# Altium schematic sheet YakupTrkn.SchDoc
size A4
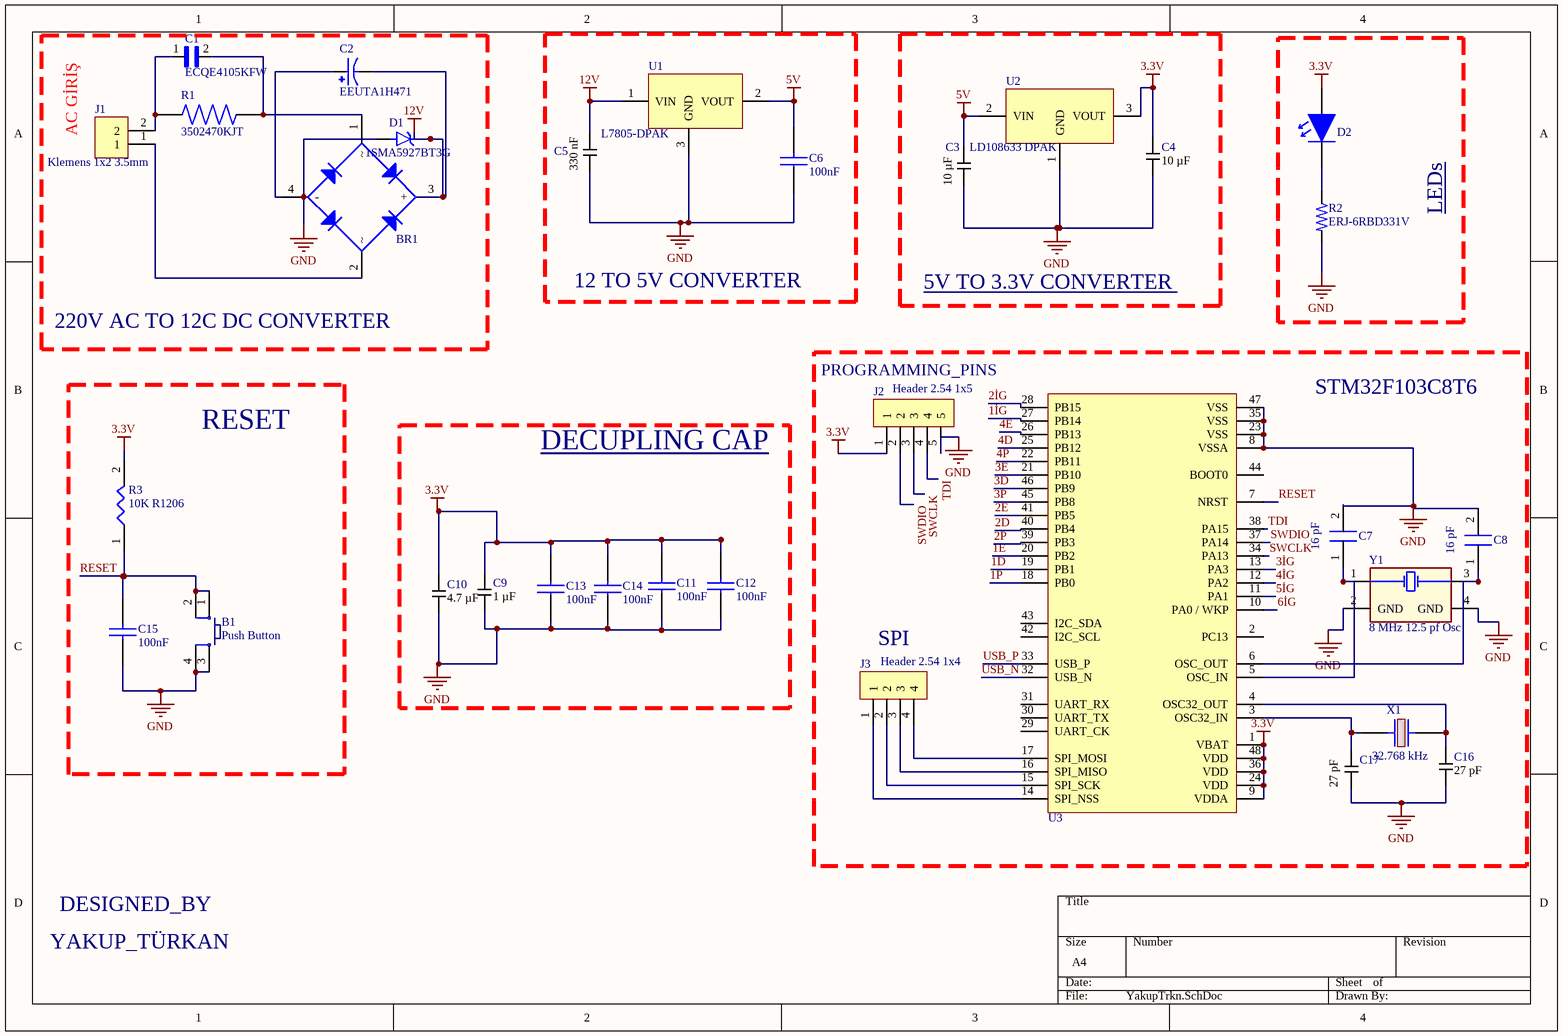
[diagram p0: YakupTrkn.SchDoc]

## Parts
B1  Push Button  [PUSB BUTTON-SMD]
BR1  DB105STR  [DB105STR]  (value not drawn)
C1  ECQE4105KFW  [CAPRR1500W80L2600T850H2300]
C2  EEUTA1H471  [CAPPRD750W80D1600H2000]
C3  Capacitance: 10 µF  [SAMSUNG_CAP_0805_140]  (hidden comment: CL21B106KPQNNNE)
C4  Capacitance: 10 µF  [SAMSUNG_CAP_0805_140]  (hidden comment: CL21B106KPQNNNE)
C5  Capacitance: 330 nF  [SAMSUNG_CAP_0805_095]  (hidden comment: CL21B334KOCNNNC)
C6  Capacitance: 100nF  [CAP_0603]  (hidden comment: C0603C104K5RACTU)
C7  16 pF  [C1206]
C8  16 pF  [C1206]
C9  Capacitance: 1 µF  [SAMSUNG_CAP_0805_135]  (hidden comment: CL21B105KBFNNNE)
C10  Capacitance: 4.7 µF  [SAMSUNG_CAP_0805_095]  (hidden comment: *)
C11  Capacitance: 100nF  [CAP_0603]  (hidden comment: C0603C104K5RACTU)
C12  Capacitance: 100nF  [CAP_0603]  (hidden comment: C0603C104K5RACTU)
C13  Capacitance: 100nF  [CAP_0603]  (hidden comment: C0603C104K5RACTU)
C14  Capacitance: 100nF  [CAP_0603]  (hidden comment: C0603C104K5RACTU)
C15  Capacitance: 100nF  [CAP_0603]  (hidden comment: C0603C104K5RACTU)
C16  Capacitance: 27 pF  [SAMSUNG_CAP_0805_075]  (hidden comment: CL21C270JBANNNC)
C17  Capacitance: 27 pF  [SAMSUNG_CAP_0805_075]  (hidden comment: CL21C270JBANNNC)
D1  1SMA5927BT3G  [DIOM5226X220N]
D2  LH R974-LP-1  [LED_RED_0805]  (value not drawn)
J1  Klemens 1x2 3.5mm  [Klemens 1x2 - 3.5mm]
J2  Header 2.54 1x5  [Header 2.54 1x5]
J3  Header 2.54 1x4  [Header 2.54 1x4]
R1  3502470KJT  [RESC5025X120N]
R2  ERJ-6RBD331V  [RESC2012X70]
R3  10K R1206  [R1206 Resıstor]
U1  L7805-DPAK  [DPAK228P972X230-3N]
U2  LD108633 DPAK  [DPAK228P972X230-3N]
U3  STM32F103C6T6A  [LQFP-48]  (value not drawn)
X1  Operating Frequency: 32.768 kHz  [ABS05]  (hidden comment: ABS05-32.768KHZ-T)
Y1  8 MHz 12.5 pf Osc  [8 MHZ Osc.]

## Nets
3.3V: C4.1 C9.2 C10.2 C11.2 C12.2 C13.2 C14.2 D2.2 J2.1 R3.2 U2.3(VOUT) U3.1(VBAT) U3.9(VDDA) U3.24(VDD) U3.36(VDD) U3.48(VDD)
5V: C3.2 C6.2 U1.2(VOUT) U2.2(VIN)
12V: BR1.3(+) C2.N C5.2 D1.C U1.1(VIN)
GND: B1.3 B1.4 C3.1 C4.2 C5.1 C6.1 C7.2 C8.2 C9.1 C10.1 C11.1 C12.1 C13.1 C14.1 C15.1 C16.1 C17.2 D1.A J2.5 R2.2 U1.3(GND) U2.1(GND) U3.8(VSSA) U3.23(VSS) U3.35(VSS) U3.47(VSS) Y1.2(GND) Y1.4(GND)
1D: U3.19(PB1)
1E: U3.20(PB2)
1İG: U3.27(PB14)
1P: U3.18(PB0)
2D: U3.40(PB4)
2E: U3.41(PB5)
2İG: U3.28(PB15)
2P: U3.39(PB3)
3D: U3.46(PB9)
3E: U3.21(PB10)
3İG: U3.13(PA3)
3P: U3.45(PB8)
4D: U3.25(PB12)
4E: U3.26(PB13)
4İG: U3.12(PA2)
4P: U3.22(PB11)
5İG: U3.11(PA1)
6İG: U3.10(PA0_/_WKP)
RESET: B1.1 B1.2 C15.2 R3.1 U3.7(NRST)
SWCLK: J2.3 U3.34(PA13)
SWDIO: J2.2 U3.37(PA14)
TDI: J2.4 U3.38(PA15)
USB_N: U3.32(USB_N)
USB_P: U3.33(USB_P)
NetBR1_1: BR1.1 C1.2 R1.2
NetBR1_2: BR1.2 J1.1
NetBR1_4: BR1.4(-) C2.P
NetC1_1: C1.1 J1.2 R1.1
NetC7_1: C7.1 U3.5(OSC_IN) Y1.1
NetC8_1: C8.1 U3.6(OSC_OUT) Y1.3
NetC16_2: C16.2 U3.4(OSC32_OUT) X1.2
NetC17_1: C17.1 U3.3(OSC32_IN) X1.1
NetD2_1: D2.1 R2.1
NetJ3_1: J3.1 U3.14(SPI_NSS)
NetJ3_2: J3.2 U3.15(SPI_SCK)
NetJ3_3: J3.3 U3.16(SPI_MISO)
NetJ3_4: J3.4 U3.17(SPI_MOSI)

Not connected (* = marked no-connect by the designer): U3 2(PC13) 29(UART_CK) 30(UART_TX) 31(UART_RX) 42(I2C_SCL) 43(I2C_SDA) 44(BOOT0)

## Notes on the sheet
- (near J1) AC GİRİŞ
- LEDs <leds>
- 12 TO 5V CONVERTER
- 5V TO 3.3V CONVERTER <5V TO 3.3V CONVERTER >
- 220V AC TO 12C DC CONVERTER
- (near J2) PROGRAMMING_PINS
- RESET
- STM32F103C8T6
- DECUPLING CAP
- (near J3) SPI
- DESIGNED_BY
- YAKUP_TÜRKAN

## Library data of the parts
B1 = Push Button: Smd Push Button; Satın Alma Linki: https://urun.n11.com/diger/mini-pushbutton-switch-smd-P227461537?gclid=Cj0KCQjwkoDmBRCcARIsAG3xzl8Y_-jeD7HocNM6lvuZ_rVp83568XPGtNzlPwXWLph8oCRqo0yh87UaApZYEALw_wcB&gclsrc=aw.ds
BR1 = DB105STR: Bridge Diode AC-DC; Manufacturer: Sangdest Microelectronics; Designed by: BERK; Max Current: 1A; Operating Voltage: 600V; Supplier 1: Digi-Key; Manufacturer Part Number: DB105STR; RoHS: No; Supplier Part Number 1: 1655-1821-1-ND
C1 = ECQE4105KFW: MF: {'manufacturer': u'Panasonic'}; MP: ECQE4105KFW; Price: None; Package: None; Value: *; Availability: Unavailable
C2 = EEUTA1H471: TA-A; MF: {'manufacturer': u'Panasonic'}; MP: EEUTA1H471; Price: None; Package: None; Value: *; Availability: Unavailable
C3 C4 = CL21B106KPQNNNE: CAP CER 10UF 10V X7R 0805; Supplier 1: Digi-Key; Supplier 2: Farnell; Supplier 3: Mouser; Supplier Part Number 1: 1276-1764-6-ND; Supplier Part Number 2: 3013487; Supplier Part Number 3: 187-CL21B106KPQNNNE
C5 = CL21B334KOCNNNC: CAP CER 0.33UF 16V X7R 0805; Supplier 1: Digi-Key; Supplier 2: Mouser; Supplier 3: Arrow Electronics; Supplier Part Number 1: 1276-1797-1-ND; Supplier Part Number 2: 187-CL21B334KOCNNNC; Supplier Part Number 3: CL21B334KOCNNNC
C6 C11-C15 = CAP CER 100nF 0603: CAP CER 100nF %10 0603 SMD; Manufacturer: KEMET; Designed by: BERK; Dielectric Material: Ceramic; Voltage Rating (DC): 50V; Tolerance: 10%; Dielectric: X7R; Dissipation Factor: 2.5%; Supplier 1: Digi-Key; Manufacturer Part Number: C0603C104K5RACTU; RoHS: Yes; Category: Ceramic Capacitors; Stock 1: 1666186; Pricing 1: 1=0,12000, 10=0,08500, 50=0,04620, 100=0,03770, 500=0,02696, 1000=0,02118 (USD); Mount: Surface Mount; Case/Package: 0603; Number of Pins: 2; Case Code (Metric): 1608; Case Code (Imperial): 0603; Contact Plating: Tin,Matte; Min Operating Temperature: -55°C; Max Operating Temperature: 125°C; Packaging: Tape and Reel; Package Quantity: 1; Termination: SMD/SMT; Voltage: 50V; Voltage Rating: 50V; Series: SMD Comm X7R; Length: 0.063inch; Width: 0.031inch; Height: 0.8mm; Thickness: 0.034inch; Lead Pitch: 0.7mm; Depth: 0.8mm; Radiation Hardening: No; RoHS Compliant: Yes; REACH SVHC: No SVHC; ComponentLink1URL: https://datasheet.ciiva.com/7823/kem-c1002-x7r-smd-7823591.pdf?src-supplier=Element14; ComponentLink1Description: https://datasheet.ciiva.com/7823/kem-c1002-x7r-smd-7823591.pdf?src-supplier=Element14; ComponentLink2URL: https://datasheet.ciiva.com/14602/70095383-14602583.pdf?src-supplier=Allied+Electronics; ComponentLink2Description: https://datasheet.ciiva.com/14602/70095383-14602583.pdf?src-supplier=Allied+Electronics; ComponentLink3URL: https://datasheet.ciiva.com/5999/kem-c1002-x7r-smd-5999400.pdf?src-supplier=Farnell; ComponentLink3Description: https://datasheet.ciiva.com/5999/kem-c1002-x7r-smd-5999400.pdf?src-supplier=Farnell; ComponentLink4URL: https://datasheet.ciiva.com/7823/kem-c1002-x7r-smd-7823592.pdf?src-supplier=Element14; ComponentLink4Description: https://datasheet.ciiva.com/7823/kem-c1002-x7r-smd-7823592.pdf?src-supplier=Element14; ComponentLink5URL: https://datasheet.ciiva.com/28645/1851736-28645640.pdf?src-supplier=Element14; ComponentLink5Description: https://datasheet.ciiva.com/28645/1851736-28645640.pdf?src-supplier=Element14; ComponentLink6URL: https://datasheet.ciiva.com/14585/70095383-14585209.pdf?src-supplier=Allied+Electronics; ComponentLink6Description: https://datasheet.ciiva.com/14585/70095383-14585209.pdf?src-supplier=Allied+Electronics; Supplier Part Number 1: 399-5089-1-ND
C9 = CL21B105KBFNNNE: CAP CER 1UF 50V X7R 0805; Supplier 1: Digi-Key; Supplier 2: Farnell; Supplier 3: Mouser; Supplier Part Number 1: 1276-1029-1-ND; Supplier Part Number 2: 3013482; Supplier Part Number 3: 187-CL21B105KBFNNNE
C10 = CL21A475KACLRNC: CAP CER 4.7UF 25V X5R 0805; Supplier 1: Digi-Key; Supplier 2: Mouser; Supplier 3: Arrow Electronics; Supplier Part Number 1: 1276-2415-1-ND; Supplier Part Number 2: 187-CL21A475KACLRNC; Supplier Part Number 3: CL21A475KACLRNC
C16 C17 = CL21C270JBANNNC: CAP CER 27PF 50V C0G/NP0 0805; Supplier 1: Digi-Key; Supplier Part Number 1: 1276-1285-1-ND
D1 = 1SMA5927BT3G: MF: {'manufacturer': u'ON Semiconductor'}; MP: 1SMA5927BT3G; Value: *; Availability: Unavailable; Package: None; Price: None
D2 = LED RED 0805: LED Uni-Color Hyper Red 660nm 2-Pin Chip 0805(2012Metric) T/R; Manufacturer: Osram Opto; Lens Color: White; Forward Voltage: 1.8V; Lens Style: Diffused,Flat,Colorless; Luminous Intensity: 71mcd; Viewing Angle: 160°; Forward Current: 30mA; Dominant Wavelength: 645nm; Number of Elements: 1; Test Current: 20mA; Reverse Voltage: 5V; Lens Transparency: Diffused; Luminous Flux: 0.17lm; Lens Size: 1.25mm; Designed by: BERK; Supplier 1: Digi-Key; Manufacturer Part Number: LH R974-LP-1; RoHS: Yes; Category: LEDs; Stock 1: 35632; Pricing 1: 1=0,26000, 10=0,13900, 100=0,06480, 500=0,05978, 1000=0,04683, 2000=0,04584 (USD); Mount: Surface Mount; Case/Package: 0805; Number of Pins: 2; Color: Red; Case Code (Imperial): 0805; Case Code (Metric): 2012; Min Operating Temperature: -30°C; Max Operating Temperature: 85°C; Packaging: Tape and Reel; Illumination Color: Red; Package Quantity: 1; Series: CHipLED; Length: 2.1mm; Width: 1.25mm; Depth: 1.35mm; Radiation Hardening: No; RoHS Compliant: Yes; ComponentLink1URL: http://www.jameco.com/Jameco/Products/ProdDS/2085634.pdf?src-supplier=Jameco; ComponentLink1Description: http://www.jameco.com/Jameco/Products/ProdDS/2085634.pdf?src-supplier=Jameco; ComponentLink2URL: http://components.arrow.com/part/dataview/0323_01825492?src-supplier=Arrow+Europe; ComponentLink2Description: http://components.arrow.com/part/dataview/0323_01825492?src-supplier=Arrow+Europe; ComponentLink3URL: https://dammedia.osram.info/media/resource/hires/osram-dam-2493888/LH%20R974.pdf?src-supplier=Digi-Key; ComponentLink3Description: https://dammedia.osram.info/media/resource/hires/osram-dam-2493888/LH%20R974.pdf?src-supplier=Digi-Key; ComponentLink4URL: http://www.mouser.com/ds/2/311/LH%20R974%20-%20CHIPLED%200805-318659.pdf?src-supplier=Mouser; ComponentLink4Description: http://www.mouser.com/ds/2/311/LH%20R974%20-%20CHIPLED%200805-318659.pdf?src-supplier=Mouser; ComponentLink5URL: https://www.verical.com/server-webapp/html/getDatasheet?partID=258950&src-supplier=Verical; ComponentLink5Description: https://www.verical.com/server-webapp/html/getDatasheet?partID=258950&src-supplier=Verical; ComponentLink6URL: http://components.arrow.com/part/dataview/41971690S1077610N9133?src-supplier=Arrow+Electronics; ComponentLink6Description: http://components.arrow.com/part/dataview/41971690S1077610N9133?src-supplier=Arrow+Electronics; ComponentLink7URL: http://components.arrow.com/part/dataview/41971690S6190115N2128?src-supplier=Arrow+Electronics; ComponentLink7Description: http://components.arrow.com/part/dataview/41971690S6190115N2128?src-supplier=Arrow+Electronics; Supplier Part Number 1: 475-1415-1-ND
R1 = 3502470KJT: MF: {'manufacturer': u'TE Connectivity'}; MP: 3502470KJT; Value: *; Availability: Unavailable; Package: None; Price: None
R2 = ERJ-6RBD331V: Thick Film Chip Res,0805, 0.5% Precision 330ohm, 5; MF: {'manufacturer': u'Panasonic'}; Price: None; MP: ERJ-6RBD331V; Value: *; Availability: Unavailable; Package: None
U1 = L7805-DPAK: L7805 5V REGULATOR. SMD PAKET
U2 = LD108633 DPAK: LD1086 3.3V REGULATOR
U3 = STM32F103C6T6A: MCU 32-bit STM32F ARM Cortex M3 RISC 32KB Flash 2.5V/3.3V 48-Pin LQFP Tray; Manufacturer: STMicroelectronics; Number of Timers/Counters: 3; Max Supply Voltage: 3.6V; Frequency: 72MHz; Interface: I2C,SPI,USART; RAM Size: 10KB; Max Power Dissipation: 363mW; Number of I/Os: 37; Min Supply Voltage: 2V; Oscillator Type: Internal; Data Bus Width: 32b; Watchdog Timer: Yes; Peripherals: POR,PWM,WDT,DMA,Temp Sensor,I2C; Number of ADC Channels: 10; Number of SPI Channels: 1; Designed by: BERK; SleepMode: OK; Supplier 1: Digi-Key; Manufacturer Part Number: STM32F103C6T6A; RoHS: Yes; Category: Microcontrollers; Stock 1: 30; Pricing 1: 1=5,07000, 10=4,55000, 25=4,30120, 80=3,72763, 250=3,53648, 500=3,18600 (USD); Case/Package: LQFP; Number of Pins: 48; Weight: 0.006409oz; Min Operating Temperature: -40°C; Max Operating Temperature: 85°C; Package Quantity: 1500; Packaging: Tray; Max Frequency: 72MHz; Number of Programmable I/O: 37; Memory Type: FLASH; Memory Size: 32KB; Core Architecture: ARM; Series: STM32F103C6; Number of I2C Channels: 1; Address Bus Width: 32b; Length: 7mm; Width: 7mm; Height: 1.4mm; Radiation Hardening: No; Lead Free: Lead Free; REACH SVHC: No SVHC; RoHS Compliant: Yes; ComponentLink1URL: https://datasheet.ciiva.com/15122/getdatasheetpartid-69879-15122075.pdf?src-supplier=Verical; ComponentLink1Description: https://datasheet.ciiva.com/15122/getdatasheetpartid-69879-15122075.pdf?src-supplier=Verical; ComponentLink2URL: https://datasheet.ciiva.com/14100/pustm-arm-microcont-stm32f103-en-14100507.pdf?src-supplier=Distrelec; ComponentLink2Description: https://datasheet.ciiva.com/14100/pustm-arm-microcont-stm32f103-en-14100507.pdf?src-supplier=Distrelec; Supplier 2: Avnet; Stock 2: 2360; Pricing 2: 250=1,99138, 260=1,95951, 510=1,91172, 1300=1,87986, 2500=1,84800, 13000=1,81613, 25000=1,78427 (USD); Supplier Part Number 1: 497-11515-ND; Supplier Part Number 2: STM32F103C6T6A
X1 = CRYSTAL 32768kHZ_1: Crystal, 32.768 kHz, SMD, 1.6mm x 1mm, 12.5 pF, 20 ppm, ABS05 Series; Manufacturer: Abracon; Frequency Tolerance: 20ppm; Load Capacitance: 12.5pF; ESR (Equivalent Series Resistance): 90kR; Designed by: BERK; Supplier 1: Digi-Key; Manufacturer Part Number: ABS05-32.768KHZ-T; RoHS: Yes; Category: Crystals; Stock 1: 180522; Pricing 1: 1=1,16000, 10=1,02500, 50=0,95760, 100=0,84630, 500=0,80180, 1000=0,66816 (USD); Mount: Surface Mount; Case/Package: SMD/SMT; Number of Pins: 2; Min Operating Temperature: -40°C; Max Operating Temperature: 85°C; Packaging: Tape and Reel; Package Quantity: 3000; Frequency: 32.768kHz; Tolerance: 20ppm; Termination: SMD/SMT; Series Resistance: 90kR; Series: ABS05; Length: 1.6mm; Width: 0.039inch; Height: 0.02inch; Depth: 1mm; Radiation Hardening: No; REACH SVHC: No SVHC; Lead Free: Lead Free; RoHS Compliant: Yes; ComponentLink1URL: https://datasheet.ciiva.com/23810/abs05-23810480.pdf?src-supplier=Newark; ComponentLink1Description: https://datasheet.ciiva.com/23810/abs05-23810480.pdf?src-supplier=Newark; ComponentLink2URL: https://datasheet.ciiva.com/6728/abs05-6728949.pdf?src-supplier=Digi-Key; ComponentLink2Description: https://datasheet.ciiva.com/6728/abs05-6728949.pdf?src-supplier=Digi-Key; ComponentLink3URL: https://datasheet.ciiva.com/6728/abs05-6728950.pdf?src-supplier=Digi-Key; ComponentLink3Description: https://datasheet.ciiva.com/6728/abs05-6728950.pdf?src-supplier=Digi-Key; ComponentLink4URL: https://datasheet.ciiva.com/16411/abs05-16411149.pdf?src-supplier=Future+Electronics; ComponentLink4Description: https://datasheet.ciiva.com/16411/abs05-16411149.pdf?src-supplier=Future+Electronics; Supplier Part Number 1: 535-11899-1-ND